# EAGLE design MK12_RelayShield (EAGLE 9.0.1)
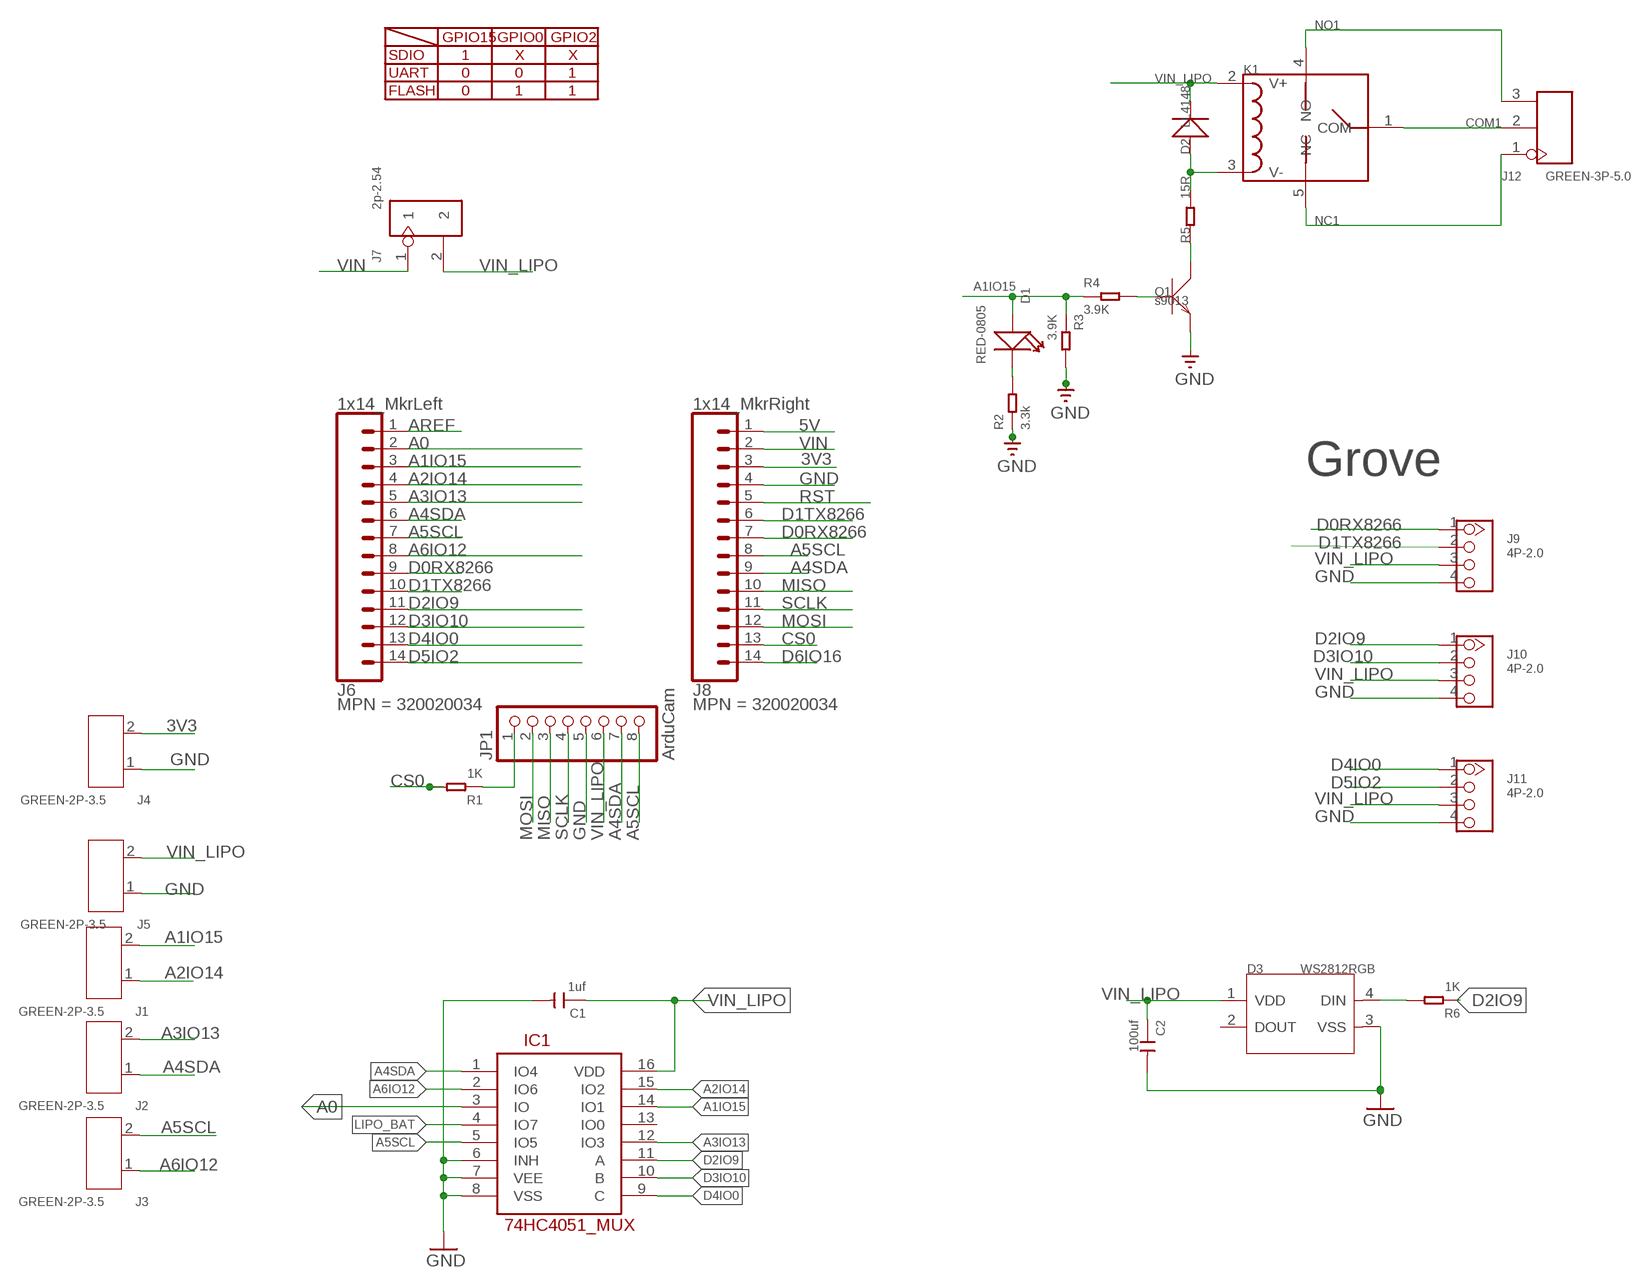
[diagram p0: schematic, sheet 1]

## Parts
C1  1uf  CERAMIC-1UF-25V-10%-X7R(0603)  [C0603]
C2  100uf  CERAMIC-100UF-6.3V-20%-X5R(1206)  [C1206]
D1  RED-0805  SMD-LED-CLEAR-RED(0805)  [LED-0805]
D2  LL4148  D'1N4148-SMD'  [LL-34]
D3  WS2812RGB  SMD-RGB-LED-4P'WS2812B'  [LED4-SMD-5050]
IC1  74HC4051_MUX  SPARKFUN_74HC4051_MUX  [SPARKFUN_SO16]
J1  GREEN-2P-3.5  SCREW-TERMINAL-GREEN(2P-3.5)  [H2-3.5-7.0X7.0MM]
J2  GREEN-2P-3.5  SCREW-TERMINAL-GREEN(2P-3.5)  [H2-3.5-7.0X7.0MM]
J3  GREEN-2P-3.5  SCREW-TERMINAL-GREEN(2P-3.5)  [H2-3.5-7.0X7.0MM]
J4  GREEN-2P-3.5  SCREW-TERMINAL-GREEN(2P-3.5)  [H2-3.5-7.0X7.0MM]
J5  GREEN-2P-3.5  SCREW-TERMINAL-GREEN(2P-3.5)  [H2-3.5-7.0X7.0MM]
J6  1x14_MkrLeft  CONN_14LOCK  [1X14_LOCK]
J7  2p-2.54  DIP-BLACK-MALE-HEADER-VERT(2P-2.54)  [H2-2.54]
J8  1x14_MkrRight  CONN_14LOCK  [1X14_LOCK]
J9  4P-2.0  GROVE-CONNECTOR-DIP(4P-2.0)  [HW4-2.0]
J10  4P-2.0  GROVE-CONNECTOR-DIP(4P-2.0)  [HW4-2.0]
J11  4P-2.0  GROVE-CONNECTOR-DIP(4P-2.0)  [HW4-2.0]
J12  GREEN-3P-5.0  SCREW-TERMINAL-GREEN(3P-5.0)  [H3-5.0-15.5X8.0MM]
JP1  ArduCam  MILLER_PINHD-1X8LOCK  [MILLER_1X08-LOCK]
K1  RELAY-HLS8L-DC5V-S-CHLS8L-DC5V-S-C  [REY5-19.0X15.0X15.0MM]
Q1  s9013  TRANSISTOR-NPN-SOT23  [SOT23]
R1  1K  SMD-RES-1K-5%-1/8W(0805)  [R0805]
R2  3.3k  SMD-RES-3.3K-5%-1/10W(0603)  [R0603]
R3  3.9K  SMD-RES-3.9K-5%-1/10W(0603)  [R0603]
R4  3.9K  SMD-RES-3.9K-5%-1/10W(0603)  [R0603]
R5  15R  R-0603  [R0603]
R6  1K  SMD-RES-1K-5%-1/8W(0805)  [R0805]

## Nets
3V3 [power]: J4.2 J8.3
5V [power]: J8.1
A0: IC1.3(IO) J6.2
A1IO15: D1.+ IC1.14(IO1) J1.2 J6.3 R3.1 R4.1
A2IO14: IC1.15(IO2) J1.1 J6.4
A3IO13: IC1.12(IO3) J2.2 J6.5
A4SDA: IC1.1(IO4) J2.1 J6.6 J8.9 JP1.7
A5SCL: IC1.5(IO5) J3.2 J6.7 J8.8 JP1.8
A6IO12: IC1.2(IO6) J3.1 J6.8
AREF: J6.1
COM1 [power2]: J12.2 K1.1(COM)
CS0: J8.13 R1.2
D0RX8266: J6.9 J8.7 J9.1
D1TX8266: J6.10 J8.6 J9.2
D2IO9: IC1.11(A) J6.11 J10.1 R6.1
D3IO10: IC1.10(B) J6.12 J10.2
D4IO0: IC1.9(C) J6.13 J11.1
D5IO2: J6.14 J11.2
D6IO16: J8.14
GND [power]: C1.2 C2.2 D3.3(VSS) IC1.6(INH) IC1.7(VEE) IC1.8(VSS) J4.1 J5.1 J8.4 J9.4 J10.4 J11.4 JP1.5 Q1.2(E) R2.1 R3.2
LIPO_BAT [power]: IC1.4(IO7)
MISO: J8.10 JP1.3
MOSI: J8.12 JP1.2
N$23: Q1.1(B) R4.2
N$32 [power2]: D2.A(+) K1.3(V-) R5.2
N$33: Q1.3(C) R5.1
N$57: D1.- R2.2
N$82: D3.4(DIN) R6.2
N$93: JP1.1 R1.1
NC1 [power2]: J12.1 K1.5(NC)
NO1 [power2]: J12.3 K1.4(NO)
RST: J8.5
SCLK: J8.11 JP1.4
VIN [power]: J7.1 J8.2
VIN_LIPO [power]: C1.1 C2.1 D2.C(-) D3.1(VDD) IC1.16(VDD) J5.2 J7.2 J9.3 J10.3 J11.3 JP1.6 K1.2(V+)
Unconnected: D3.2(DOUT) IC1.13(IO0)

## Notes on the sheet
- GPIO15 | GPIO0 | GPIO2
- SDIO | 1 | X | X
- UART | 0 | 0 | 1
- FLASH | 0 | 1 | 1
- Grove

## Library data of the parts
C1 = Seeed-Capacitor:CERAMIC-1UF-25V-10%-X7R(0603): 302010139; MPN: CC0603KRX7R8BB105
C2 = Seeed-Capacitor:CERAMIC-100UF-6.3V-20%-X5R(1206): 302010183; MPN: GRM31CR60J107ME39L
D1 = Seeed-LED:SMD-LED-CLEAR-RED(0805): 304090046; MPN: 17-215SURC/S530-A2/TR8
D2 = Discrete:D*
D3 = Seeed-Diode:SMD-RGB-LED-4P: 304990003
IC1 = Mkr4_12F:SPARKFUN_74HC4051_MUX
J1-J5 = Seeed-Connector:SCREW-TERMINAL-GREEN(2P-3.5): 320110028
J6 J8 = SparkFun-Connectors:CONN_14: Multi connection point. Often used as Generic Header-pin footprint for 0.1 inch spaced/style header connections On any of the 0.1 inch spaced packages, you can populate with these: Break Away Headers - Straight <https://www.sparkfun.com/products/116> (PRT-00116) Break Away Male Headers - Right Angle <https://www.sparkfun.com/products/553> (PRT-00553) Female Headers <https://www.sparkfun.com/products/115> (PRT-00115) Break Away Headers - Machine Pin <https://www.sparkfun.com/products/117> (PRT-00117) Break Away Female Headers - Swiss Machine Pin <https://www.sparkfun.com/products/743> (PRT-00743) For SCREWTERMINALS and SPRING TERMINALS visit here: Screw Terimnals on SparkFun.com <https://www.sparkfun.com/search/results?term=Screw+Terminals> (5mm/3.5mm/2.54mm spacing) This device is also useful as a general connection point to wire up your design to another part of your project. Our various solder wires solder well into these plated through hole pads. Hook-Up Wire - Assortment (Stranded, 22 AWG) <https://www.sparkfun.com/products/11375> (PRT-11375) Hook-Up Wire - Assortment (Solid Core, 22 AWG) <https://www.sparkfun.com/products/11367> (PRT-11367) View the entire wire category on our website here <https://www.sparkfun.com/categories/141> Special notes: Molex polarized connector foot print use with SKU : PRT-08231 with associated crimp pins and housings. 1MM SMD Version SKU: PRT-10208 NOTES ON THE VARIANTS LOCK and LOCK_LONGPADS... This footprint was designed to help hold the alignment of a through-hole component (i.e. 6-pin header) while soldering it into place. You may notice that each hole has been shifted either up or down by 0.005 of an inch from it's more standard position (which is a perfectly straight line). This slight alteration caused the pins (the squares in the middle) to touch the edges of the holes. Because they are alternating, it causes a "brace" to hold the component in place. 0.005 has proven to be the perfect amount of "off-center" position when using our standard breakaway headers. Although looks a little odd when you look at the bare footprint, once you have a header in there, the alteration is very hard to notice. Also,if you push a header all the way into place, it is covered up entirely on the bottom side.; MPN: 320020034
J7 = Seeed-Connector:DIP-BLACK-MALE-HEADER-VERT(2P-2.54): 320020016; MPN: P125-1102A0BS116A1
J9-J11 = Seeed-Connector:GROVE-CONNECTOR-DIP(4P-2.0): 320110033
J12 = Seeed-Connector:SCREW-TERMINAL-GREEN(3P-5.0): 320110029
JP1 = MKR12FUNO99:MILLER_PINHD-1X8: PIN HEADER
K1 = Seeed-Relay:RELAY-HLS8L-DC5V-S-C: 315030000
Q1 = Discrete:TRANSISTOR-NPN*: NPN audion
R1 R6 = Seeed-Resistor:SMD-RES-1K-5%-1/8W(0805): 301010311; MPN: RC0805JR-071KL
R2 = Seeed-Resistor:SMD-RES-3.3K-5%-1/10W(0603): 301010112
R3 R4 = Seeed-Resistor:SMD-RES-3.9K-5%-1/10W(0603): 301010101; MPN: RC0603JR-073K9L
R5 = Discrete:R*

## Net classes
0 default: width 0.178 mm, drill 0.305 mm, clearance 0.178 mm
1 power: width 0.508 mm, clearance 0.254 mm
2 power2: width 1.016 mm, drill 0.254 mm, clearance 0.508 mm

## Board
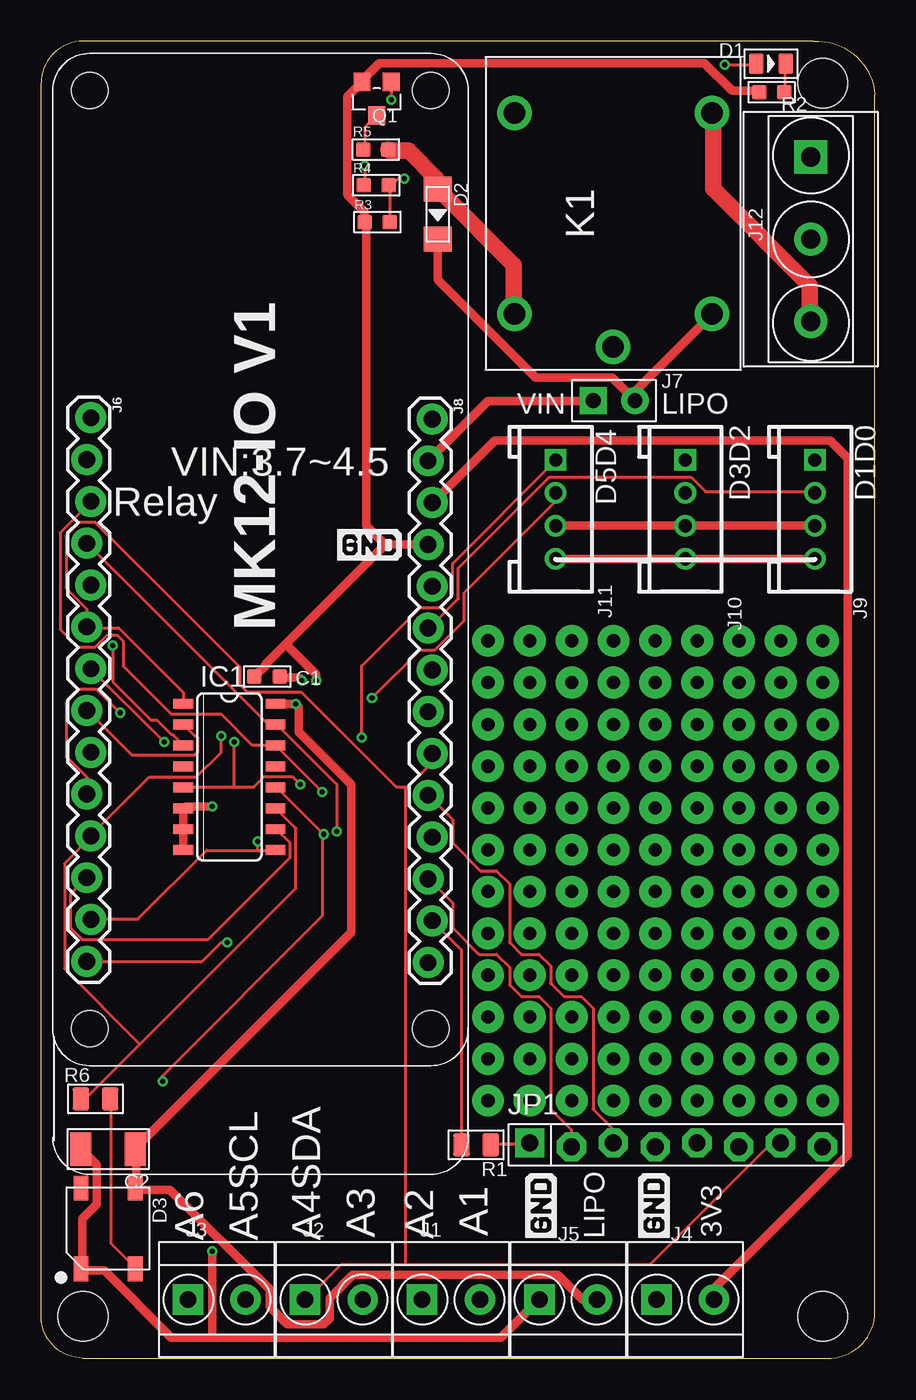
[diagram p1: board, top side]
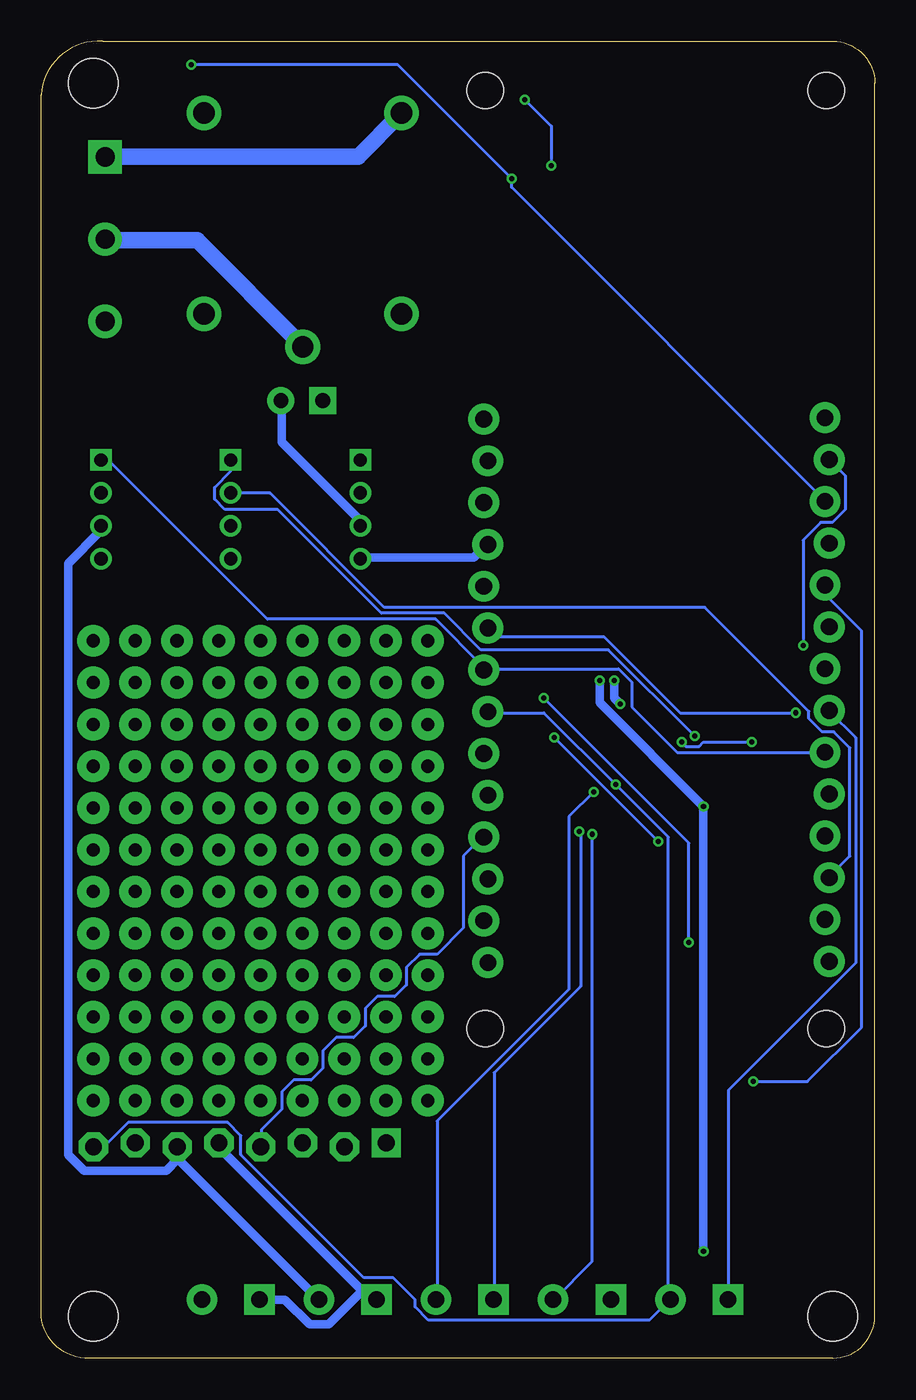
[diagram p2: board, bottom side, seen from below]

Size 50.62 x 80.02 mm. Coordinates in mm from the lower left corner, seen from the top.
Outline: 2.54,0.02 47.46,0.02 arc90 50.62,2.56 50.62,76.76 arc90 46.9,80.02 2.54,80.02 arc90 0,77.48 0,2.56 arc90 2.54,0.02
Copper layers (1*16): Top 0.035mm / dielectric 1.5mm / Bottom 0.035mm
Design rules "SeeedStudio_2layer_DRU_no_angle_20140221": minimum track width 6mil, minimum drill 12mil, track to track 6mil, track to pad 6mil, pad to pad 6mil, via to via 6mil, smd to smd 0mil, copper to edge 10mil, drill to drill 10mil, minimum pad ring 10mil, minimum via ring 6mil, stop-mask expansion 2mil, vias tented up to drill 100mil, thermal gap 10mil
Holes 3 mm at 47.46,2.56 47.46,77.48 2.54,2.56
Holes 2.2 mm at 2.95,20.03 2.95,77.03 23.65,77.03 23.65,20.03

### Footprints (pad centres in the part's own frame; a part is rotated, then mirrored left to right if it is on the bottom)
C0603 = smd 0.889 x 0.889: 1 0,0.762; 2 0,-0.762
C1206 = smd 1.27 x 2.032: 1 -1.651,0; 2 1.651,0
LED-0805 = smd 0.889 x 1.27: + -0.889,0; - 0.889,0
LL-34 = smd 1.524 x 1.676: A -1.524,0; C 1.524,0
LED4-SMD-5050 = smd 1.5 x 0.9: 1 -2.45,1.65; 2 -2.45,-1.65; 3 2.45,-1.65; 4 2.45,1.65
SPARKFUN_SO16 = smd 0.6 x 1.2: 1 -4.445,-2.8; 2 -3.175,-2.8; 3 -1.905,-2.8; 4 -0.635,-2.8; 5 0.635,-2.8; 6 1.905,-2.8; 7 3.175,-2.8; 8 4.445,-2.8; 9 4.445,2.8; 10 3.175,2.8; 11 1.905,2.8; 12 0.635,2.8; 13 -0.635,2.8; 14 -1.905,2.8; 15 -3.175,2.8; 16 -4.445,2.8
H2-3.5-7.0X7.0MM = drill 1 pad 1.85 square: 1 -1.75,0 | drill 1 pad 1.85: 2 1.75,0
1X14_LOCK = drill 1.016 pad 1.88: 1 0,0.127; 2 2.54,-0.127; 3 5.08,0.127; 4 7.62,-0.127; 5 10.16,0.127; 6 12.7,-0.127; 7 15.24,0.127; 8 17.78,-0.127; 9 20.32,0.127; 10 22.86,-0.127; 11 25.4,0.127; 12 27.94,-0.127; 13 30.48,0.127; 14 33.02,-0.127
H2-2.54 = drill 0.889 pad 1.651 square: 1 0,1.27 | drill 0.889 pad 1.651: 2 0,-1.27
HW4-2.0 = drill 0.8 pad 1.27 square: 1 -3,0 | drill 0.8 pad 1.27: 2 -1,0; 3 1,0; 4 3,0
H3-5.0-15.5X8.0MM = drill 1.168 pad 2.032 square: 1 0,5 | drill 1.168 pad 2.032: 2 0,0; 3 0,-5
MILLER_1X08-LOCK = drill 1.016 pad 1.778 square: 1 -8.89,0.127 | drill 1.016 pad 1.778 octagon: 2 -6.35,-0.127; 3 -3.81,0.127; 4 -1.27,-0.127; 5 1.27,0.127; 6 3.81,-0.127; 7 6.35,0.127; 8 8.89,-0.127
REY5-19.0X15.0X15.0MM = drill 1.3 pad 2.1: 1 -8.1,0; 2 -6.1,-6; 3 -6.1,6; 4 6.1,-6; 5 6.1,6
SOT23 = smd 1.016 x 1.143: 1 -0.889,-1.016; 2 0.889,-1.016; 3 0,1.016
R0805 = smd 1.397 x 1.016: 1 0,0.889; 2 0,-0.889
R0603 = smd 0.889 x 0.889: 1 0,0.762; 2 0,-0.762
R0603' = smd 0.889 x 0.889: 1 -0.762,0; 2 0.762,0

### Placement (x,y rotation side)
C1  13.72,41.42 270 top
C2  4.06,12.72 180 top
D1  44.33,78.65 0 top
D2  24.09,69.52 270 top
D3  4.06,7.89 270 top
IC1  11.43,35.32 270 top
J1  24.89,3.57 0 top
J2  17.78,3.57 0 top
J3  10.67,3.57 0 top
J4  39.12,3.57 0 top
J5  32,3.57 0 top
J6  2.9,57.14 270 top
J7  34.8,58.18 90 top
J8  23.62,57.07 270 top
J9  46.99,51.58 270 top
J10  39.12,51.58 270 top
J11  31.24,51.58 270 top
J12  46.74,67.99 0 top
JP1  38.56,12.97 0 top
K1  34.74,69.56 90 top
Q1  20.38,76.52 180 top
R1  26.42,12.97 270 top
R2  44.37,76.92 90 top
R3  20.42,69.03 270 top
R4  20.35,71.26 270 top
R5  15R  [R0603']  20.33,73.43 0 top
R6  3.3,15.76 90 top

### Tracks (layer width: path | path; a pad name or v marks a point on that pad's centre or on a via)
3V3
  Top 0.508: J4.2 40.89,3.57 40.89,4.28 48.98,12.37 48.98,54.69 47.92,55.76 27.56,55.76 23.82,52.02 J8.3
A0  (via drill 0.3)
  Top 0.178: v4.36,43.31 4.36,41.09 6.67,38.78 7.02,38.78 7.91,37.89 8,37.89 8.62,37.27 IC1.3
  Bottom 0.178: v4.36,43.31 4.36,49.71 3.29,50.78 2.58,50.78 1.78,51.58 1.78,53.62 2.76,54.6 J6.2
A1IO15  (via drill 0.3)
  Top 0.178: R3.1 21.16,69.09 21.16,71.23 R4.1 21.25,71.23 21.69,71.67 v22.05,71.67 | v41.52,78.6 43.38,78.6 D1.+ | J6.3 3.02,52.02 1.16,50.16 1.16,44.29 2.22,43.22 3.29,43.22 4,43.93 4.62,43.93 4.98,43.58 4.98,42.07 7.91,39.13 10.94,39.13 12.8,37.27 14.22,37.27 IC1.14 14.31,37.18 v17.07,34.42
  Bottom 0.178: v41.52,78.6 28.98,78.6 v22.05,71.67 22.05,71.14 3.02,52.11 J6.3 | v17.07,34.42 18.58,32.91 18.58,22.42 26.58,14.42 26.58,3.57 J1.2
A2IO14  (via drill 0.3)
  Top 0.178: J6.4 13.78,38.51 14.22,38.51 IC1.15 14.31,38.51 17.96,34.87 v17.96,32.02
  Bottom 0.178: v17.96,32.02 17.87,31.93 17.87,22.6 23.11,17.35 23.11,3.57 J1.1
A3IO13  (via drill 0.3)
  Top 0.178: IC1.12 14.31,34.69 v17.16,31.84 17.07,31.84 17.07,26.86 7.38,17.17 v7.38,16.82
  Bottom 0.178: v17.16,31.84 17.16,5.88 19.47,3.57 J2.2 | J6.5 3.02,46.42 0.8,44.2 0.8,20.11 4.09,16.82 v7.38,16.82
A4SDA
  Top 0.178: IC1.1 8.62,39.84 8.62,40.47 4.71,44.38 2.85,44.38 J6.6 2.76,44.47 2.76,45.53 1.51,46.78 1.51,49.98 2.31,50.78 3.29,50.78 12.09,41.98 12.09,40.91 12.54,40.47 15.82,40.47 21.6,34.69 22.14,34.69 22.18,34.64 | 22.14,5.71 18.22,5.71 16.09,3.57 J2.1 | 22.14,5.71 36.98,5.71 44.36,13.08 44.9,13.08 JP1.7 | 22.18,34.64 22.14,34.6 22.14,5.71 | 22.18,34.64 23.74,36.2 23.74,36.73 J8.9
A5SCL  (via drill 0.3)
  Top 0.178: 11.73,34.69 12.89,34.69 13.51,35.31 15.29,35.31 v15.73,34.87 | 11.73,34.69 IC1.5 | v7.47,37.44 J6.7 | 11.73,34.69 v11.73,37.44
  Bottom 0.178: J8.8 23.47,39.22 20.09,39.22 v15.73,34.87 12.54,31.66 12.54,3.57 J3.2 12.45,3.57 13.69,2.33 27.11,2.33 27.91,3.13 27.91,3.57 29.25,4.91 31.03,4.91 38.49,12.37 38.49,13.53 39.29,14.33 45.34,14.33 46.76,12.91 47.38,12.91 JP1.8 | v7.47,37.44 10.4,37.44 10.67,37.18 11.47,37.18 v11.73,37.44
A6IO12
  Top 0.178: IC1.2 8.71,38.42 9.34,37.8 9.42,37.8 9.51,37.71 9.51,36.82 9.34,36.64 5.51,36.64 2.85,39.31 J6.8
  Bottom 0.178: J3.1 8.89,3.57 8.89,16.29 1.16,24.02 1.16,37.71 2.76,39.31 J6.8
COM1
  Bottom 1.016: J12.2 46.67,67.94 41.16,67.94 34.76,61.54 K1.1
CS0
  Top 0.178: J8.13 25.51,24.82 25.51,13 R1.2
D0RX8266
  Bottom 0.178: J9.1 46.94,54.51 46.49,54.51 36.89,44.91 26.67,44.91 23.82,42.07 23.82,41.89 J8.7 23.74,41.89 15.56,41.89 14.76,41.09 14.76,39.58 12,36.82 J6.9
D1TX8266  (via drill 0.3)
  Top 0.178: J9.2 46.94,52.65 40.36,52.65 39.47,53.53 30.85,53.53 25.34,48.02 25.34,46.16 23.56,44.38 J8.6 | v4.8,39.22 3.38,40.64 2.31,40.64 1.51,39.84 1.51,36.55 2.76,35.31 2.76,34.33 J6.10
  Bottom 0.178: v4.8,39.22 11.82,39.22 16.45,43.84 23.02,43.84 23.47,44.29 J8.6
D2IO9  (via drill 0.3)
  Top 0.178: 6,19.09 2.76,15.84 2.49,15.84 R6.1 | 6,19.09 15.47,28.55 15.47,32.2 14.31,33.35 IC1.11 | v10.94,37.8 10.94,36.82 9.42,35.31 6.58,35.31 3.02,31.75 J6.11 3.02,31.66 1.42,30.06 1.42,23.66 6,19.09
  Bottom 0.178: J10.1 39.12,53.89 40.09,52.91 40.09,52.2 39.47,51.58 36.27,51.58 29.96,45.27 26.14,45.27 23.91,43.04 16.18,43.04 v10.94,37.8
D3IO10
  Top 0.178: IC1.10 14.31,32.11 15.11,31.31 15.11,30.42 10.13,25.44 2.49,25.44 1.78,26.15 1.78,28.2 2.76,29.18 J6.12
  Bottom 0.178: J10.2 39.12,52.56 36.72,52.56 29.78,45.62 10.31,45.62 4,39.31 4,38.87 3.2,38.07 2.49,38.07 1.51,37.09 1.51,30.51 2.76,29.26 J6.12
D4IO0  (via drill 0.3)
  Top 0.178: 13.16,30.86 10.05,30.86 5.87,26.69 3.02,26.69 J6.13 | 13.16,30.86 14.22,30.86 IC1.9 | v19.47,37.71 19.47,42.07 23.02,45.62 24.18,45.62 24.98,46.42 24.98,48.29 31.2,54.51 J11.1 | 13.16,30.86 v13.16,31.4
  Bottom 0.178: v13.16,31.4 v19.47,37.71
D5IO2  (via drill 0.3)
  Top 0.178: v20.09,40.11 23.02,43.04 23.91,43.04 25.69,44.82 25.69,46.51 31.2,52.02 31.2,52.56 J11.2 | v11.29,25.26 10.94,25.26 9.78,24.11 2.85,24.11 J6.14
  Bottom 0.178: v20.09,40.11 11.29,31.31 v11.29,25.26
GND  (via drill 0.3)
  Top 0.508: C2.2 3.38,11.75 3.38,9.35 2.49,8.46 2.49,5.53 D3.3 2.67,5.35 3.82,5.35 7.91,1.26 10.4,1.26 | 10.4,1.26 27.91,1.26 30.23,3.57 J5.1 | R2.1 43.56,77 41.96,77 40.27,78.69 20.54,78.69 19.56,77.72 Q1.2 19.47,77.54 18.58,76.65 18.58,70.69 19.65,69.63 19.65,69.09 R3.2 19.74,68.83 19.74,50.6 20.89,49.44 | J11.4 31.29,48.56 39.12,48.56 J10.4 39.29,48.56 46.94,48.56 J9.4 | IC1.8 8.62,30.95 8.62,32.11 IC1.7 8.62,32.38 8.62,33.35 IC1.6 8.8,33.53 v10.4,33.53 | C1.2 13.6,42.07 13.6,42.16 14.85,43.4 | 20.89,49.44 14.85,43.4 | J8.4 20.89,49.44 | v16.71,41.18 16.71,41.53 14.85,43.4 | v10.4,6.51 10.4,1.26
  Bottom 0.508: JP1.5 39.83,12.82 31.11,4.11 | 31.11,4.11 30.58,3.57 J5.1 | J4.1 35.83,3.57 34.31,2.06 33.16,2.06 31.11,4.11 | v16.71,41.18 16.71,39.84 v10.4,33.53 v10.4,6.51 | J11.4 31.2,48.64 24.36,48.64 23.56,49.44 J8.4
MISO
  Top 0.178: JP1.3 34.67,13.17 34.67,13.97 33.52,15.13 33.52,21.26 32.8,21.97 31.74,21.97 30.94,22.77 30.94,23.84 30.23,24.55 29.16,24.55 28.45,25.26 28.45,28.82 27.65,29.62 26.67,29.62 24.98,31.31 24.98,32.73 23.56,34.15 J8.10
MOSI
  Top 0.178: JP1.2 32.18,12.91 32.18,13.88 30.94,15.13 30.94,21.26 30.23,21.97 29.16,21.97 28.45,22.69 28.45,23.75 27.65,24.55 26.58,24.55 24.98,26.15 24.98,27.66 23.56,29.09 J8.12
N$3  (via drill 0.8 pad 1.93)
  other vias: 47.46,30.9
N$4  (via drill 0.8 pad 1.93)
  other vias: 42.38,38.52
N$5  (via drill 0.8 pad 1.93)
  other vias: 37.3,28.36
N$6  (via drill 0.8 pad 1.93)
  other vias: 47.46,25.82
N$7  (via drill 0.8 pad 1.93)
  other vias: 47.46,23.28
N$8  (via drill 0.8 pad 1.93)
  other vias: 47.46,20.74
N$9  (via drill 0.8 pad 1.93)
  other vias: 47.46,18.2
N$10  (via drill 0.8 pad 1.93)
  other vias: 47.46,15.66
N$23  (via drill 0.3)
  Top 0.178: v19.65,72.47 19.65,71.31 R4.2 | v21.25,76.47 21.25,77.54 Q1.1
  Bottom 0.178: v19.65,72.47 19.65,74.87 v21.25,76.47
N$24  (via drill 0.8 pad 1.93)
  other vias: 27.14,38.52
N$25  (via drill 0.8 pad 1.93)
  other vias: 27.14,33.44
N$26  (via drill 0.8 pad 1.93)
  other vias: 27.14,35.98
N$27  (via drill 0.8 pad 1.93)
  other vias: 27.14,30.9
N$28  (via drill 0.8 pad 1.93)
  other vias: 27.14,28.36
N$29  (via drill 0.8 pad 1.93)
  other vias: 27.14,25.82
N$30  (via drill 0.8 pad 1.93)
  other vias: 27.14,23.28
N$31  (via drill 0.8 pad 1.93)
  other vias: 27.14,20.74
N$32
  Top 1.016: R5.2 21.16,73.36 22.31,73.36 24,71.67 24,71.05 D2.A 24.45,70.69 28.71,66.42 28.71,63.49 K1.3
N$33
  Top 0.178: R5.1 19.65,73.45 19.65,74.78 20.36,75.49 Q1.3
N$57
  Top 0.178: R2.2 45.16,77 45.16,78.6 D1.-
N$59  (via drill 0.8 pad 1.93)
  other vias: 29.68,43.6
N$76  (via drill 0.8 pad 1.93)
  other vias: 29.68,41.06
N$78  (via drill 0.8 pad 1.93)
  other vias: 32.22,41.06
N$80  (via drill 0.8 pad 1.93)
  other vias: 32.22,43.6
N$82
  Top 0.178: R6.2 4.27,15.75 4.27,6.95 5.69,5.53 D3.4
N$86  (via drill 0.8 pad 1.93)
  other vias: 27.14,18.2
N$92  (via drill 0.8 pad 1.93)
  other vias: 27.14,15.66
N$93
  Top 0.178: R1.1 27.38,13 29.52,13 29.6,13.08 JP1.1
N$94  (via drill 0.8 pad 1.93)
  other vias: 34.76,41.06
N$95  (via drill 0.8 pad 1.93)
  other vias: 37.3,41.06
N$96  (via drill 0.8 pad 1.93)
  other vias: 34.76,43.6
N$97  (via drill 0.8 pad 1.93)
  other vias: 39.84,41.06
N$98  (via drill 0.8 pad 1.93)
  other vias: 37.3,43.6
N$99  (via drill 0.8 pad 1.93)
  other vias: 47.46,41.06
N$100  (via drill 0.8 pad 1.93)
  other vias: 44.92,41.06
N$101  (via drill 0.8 pad 1.93)
  other vias: 47.46,43.6
N$102  (via drill 0.8 pad 1.93)
  other vias: 44.92,43.6
N$103  (via drill 0.8 pad 1.93)
  other vias: 42.38,41.06
N$107  (via drill 0.8 pad 1.93)
  other vias: 39.84,43.6
N$108  (via drill 0.8 pad 1.93)
  other vias: 42.38,43.6
N$109  (via drill 0.8 pad 1.93)
  other vias: 27.14,43.6
N$110  (via drill 0.8 pad 1.93)
  other vias: 27.14,41.06
N$114  (via drill 0.8 pad 1.93)
  other vias: 29.68,15.66
N$115  (via drill 0.8 pad 1.93)
  other vias: 32.22,15.66
N$116  (via drill 0.8 pad 1.93)
  other vias: 34.76,15.66
N$117  (via drill 0.8 pad 1.93)
  other vias: 37.3,15.66
N$122  (via drill 0.8 pad 1.93)
  other vias: 39.84,15.66
N$124  (via drill 0.8 pad 1.93)
  other vias: 42.38,15.66
N$131  (via drill 0.8 pad 1.93)
  other vias: 44.92,15.66
N$136  (via drill 0.8 pad 1.93)
  other vias: 29.68,18.2
N$140  (via drill 0.8 pad 1.93)
  other vias: 32.22,18.2
N$142  (via drill 0.8 pad 1.93)
  other vias: 34.76,18.2
N$155  (via drill 0.8 pad 1.93)
  other vias: 37.3,18.2
N$157  (via drill 0.8 pad 1.93)
  other vias: 39.84,18.2
N$172  (via drill 0.8 pad 1.93)
  other vias: 42.38,18.2
N$175  (via drill 0.8 pad 1.93)
  other vias: 44.92,18.2
N$179  (via drill 0.8 pad 1.93)
  other vias: 29.68,20.74
N$180  (via drill 0.8 pad 1.93)
  other vias: 32.22,20.74
N$185  (via drill 0.8 pad 1.93)
  other vias: 34.76,20.74
N$186  (via drill 0.8 pad 1.93)
  other vias: 37.3,20.74
N$191  (via drill 0.8 pad 1.93)
  other vias: 39.84,20.74
N$192  (via drill 0.8 pad 1.93)
  other vias: 42.38,20.74
N$196  (via drill 0.8 pad 1.93)
  other vias: 44.92,20.74
N$197  (via drill 0.8 pad 1.93)
  other vias: 29.68,23.28
N$198  (via drill 0.8 pad 1.93)
  other vias: 32.22,23.28
N$199  (via drill 0.8 pad 1.93)
  other vias: 34.76,23.28
N$200  (via drill 0.8 pad 1.93)
  other vias: 37.3,23.28
N$201  (via drill 0.8 pad 1.93)
  other vias: 39.84,23.28
N$202  (via drill 0.8 pad 1.93)
  other vias: 42.38,23.28
N$203  (via drill 0.8 pad 1.93)
  other vias: 44.92,23.28
N$204  (via drill 0.8 pad 1.93)
  other vias: 29.68,25.82
N$205  (via drill 0.8 pad 1.93)
  other vias: 32.22,25.82
N$206  (via drill 0.8 pad 1.93)
  other vias: 34.76,25.82
N$207  (via drill 0.8 pad 1.93)
  other vias: 37.3,25.82
N$208  (via drill 0.8 pad 1.93)
  other vias: 39.84,25.82
N$209  (via drill 0.8 pad 1.93)
  other vias: 42.38,25.82
N$210  (via drill 0.8 pad 1.93)
  other vias: 44.92,25.82
N$211  (via drill 0.8 pad 1.93)
  other vias: 47.46,28.36
N$212  (via drill 0.8 pad 1.93)
  other vias: 44.92,28.36
N$213  (via drill 0.8 pad 1.93)
  other vias: 42.38,28.36
N$214  (via drill 0.8 pad 1.93)
  other vias: 39.84,28.36
N$215  (via drill 0.8 pad 1.93)
  other vias: 32.22,28.36
N$216  (via drill 0.8 pad 1.93)
  other vias: 34.76,28.36
N$217  (via drill 0.8 pad 1.93)
  other vias: 29.68,28.36
N$218  (via drill 0.8 pad 1.93)
  other vias: 29.68,30.9
N$219  (via drill 0.8 pad 1.93)
  other vias: 32.22,30.9
N$220  (via drill 0.8 pad 1.93)
  other vias: 34.76,30.9
N$221  (via drill 0.8 pad 1.93)
  other vias: 37.3,30.9
N$222  (via drill 0.8 pad 1.93)
  other vias: 39.84,30.9
N$223  (via drill 0.8 pad 1.93)
  other vias: 42.38,30.9
N$224  (via drill 0.8 pad 1.93)
  other vias: 44.92,30.9
N$225  (via drill 0.8 pad 1.93)
  other vias: 29.68,35.98
N$226  (via drill 0.8 pad 1.93)
  other vias: 29.68,38.52
N$227  (via drill 0.8 pad 1.93)
  other vias: 29.68,33.44
N$228  (via drill 0.8 pad 1.93)
  other vias: 32.22,33.44
N$229  (via drill 0.8 pad 1.93)
  other vias: 32.22,35.98
N$230  (via drill 0.8 pad 1.93)
  other vias: 32.22,38.52
N$231  (via drill 0.8 pad 1.93)
  other vias: 34.76,35.98
N$232  (via drill 0.8 pad 1.93)
  other vias: 34.76,33.44
N$233  (via drill 0.8 pad 1.93)
  other vias: 37.3,33.44
N$234  (via drill 0.8 pad 1.93)
  other vias: 37.3,35.98
N$235  (via drill 0.8 pad 1.93)
  other vias: 34.76,38.52
N$236  (via drill 0.8 pad 1.93)
  other vias: 39.84,35.98
N$237  (via drill 0.8 pad 1.93)
  other vias: 37.3,38.52
N$238  (via drill 0.8 pad 1.93)
  other vias: 39.84,33.44
N$239  (via drill 0.8 pad 1.93)
  other vias: 44.92,33.44
N$240  (via drill 0.8 pad 1.93)
  other vias: 42.38,33.44
N$241  (via drill 0.8 pad 1.93)
  other vias: 47.46,33.44
N$242  (via drill 0.8 pad 1.93)
  other vias: 47.46,35.98
N$243  (via drill 0.8 pad 1.93)
  other vias: 44.92,35.98
N$244  (via drill 0.8 pad 1.93)
  other vias: 47.46,38.52
N$245  (via drill 0.8 pad 1.93)
  other vias: 44.92,38.52
N$246  (via drill 0.8 pad 1.93)
  other vias: 42.38,35.98
N$247  (via drill 0.8 pad 1.93)
  other vias: 39.84,38.52
NC1
  Bottom 1.016: J12.1 46.67,73 31.38,73 28.8,75.58 K1.5
NO1
  Top 1.016: J12.3 46.67,63.05 46.67,65.18 40.8,71.05 40.8,75.58 K1.4
SCLK
  Bottom 0.178: JP1.4 37.25,12.91 37.25,13.88 36.01,15.13 36.01,16.2 35.29,16.91 34.23,16.91 33.52,17.62 33.52,18.69 32.72,19.49 31.65,19.49 30.94,20.2 30.94,21.26 30.23,21.97 29.16,21.97 28.45,22.69 28.45,23.75 27.65,24.55 26.58,24.55 24.98,26.15 24.98,30.51 23.82,31.66 J8.11
VIN
  Top 0.508: J7.1 33.52,58.16 27.11,58.16 23.56,54.6 J8.2
VIN_LIPO  (via drill 0.3)
  Top 0.508: J11.3 31.29,50.6 39.12,50.6 J10.3 39.29,50.6 46.94,50.6 J9.3 | D2.C 24.09,67.94 24.09,65.54 30.05,59.58 34.67,59.58 J7.2 35.92,58.6 40.72,63.4 K1.2 | v15.82,41.18 15.65,41.36 14.49,41.36 C1.1 | IC1.16 14.31,39.75 v15.47,39.75 15.65,39.58 15.65,38.07 18.85,34.87 18.85,25.89 5.87,12.91 C2.1 5.78,12.64 5.78,10.42 D3.1 5.96,10.24 7.82,10.24 13.87,4.19 13.87,3.13 14.94,2.06 17.16,2.06 17.51,2.42 17.51,3.66 18.94,5.08 31.38,5.08 32.89,3.57 J5.2
  Bottom 0.508: J11.3 31.29,50.6 31.29,50.96 36.01,55.67 36.01,58.16 J7.2 | 42.32,12.11 42.32,12.82 JP1.6 | 42.32,12.11 33.78,3.57 J5.2 | v15.82,41.18 15.82,40.11 v15.47,39.75 | 42.32,12.11 43.03,11.4 48.01,11.4 48.98,12.37 48.98,48.29 47.03,50.24 47.03,50.51 J9.3

### Text on the board
tPlace: VIN | LIPO | VIN:3.7~4.5 | D5D4 | D3D2 | D1D0 | Relay | MK12-IO V1 | A6 | A5SCL | A4SDA | A3 | A2 | A1 | LIPO | 3V3